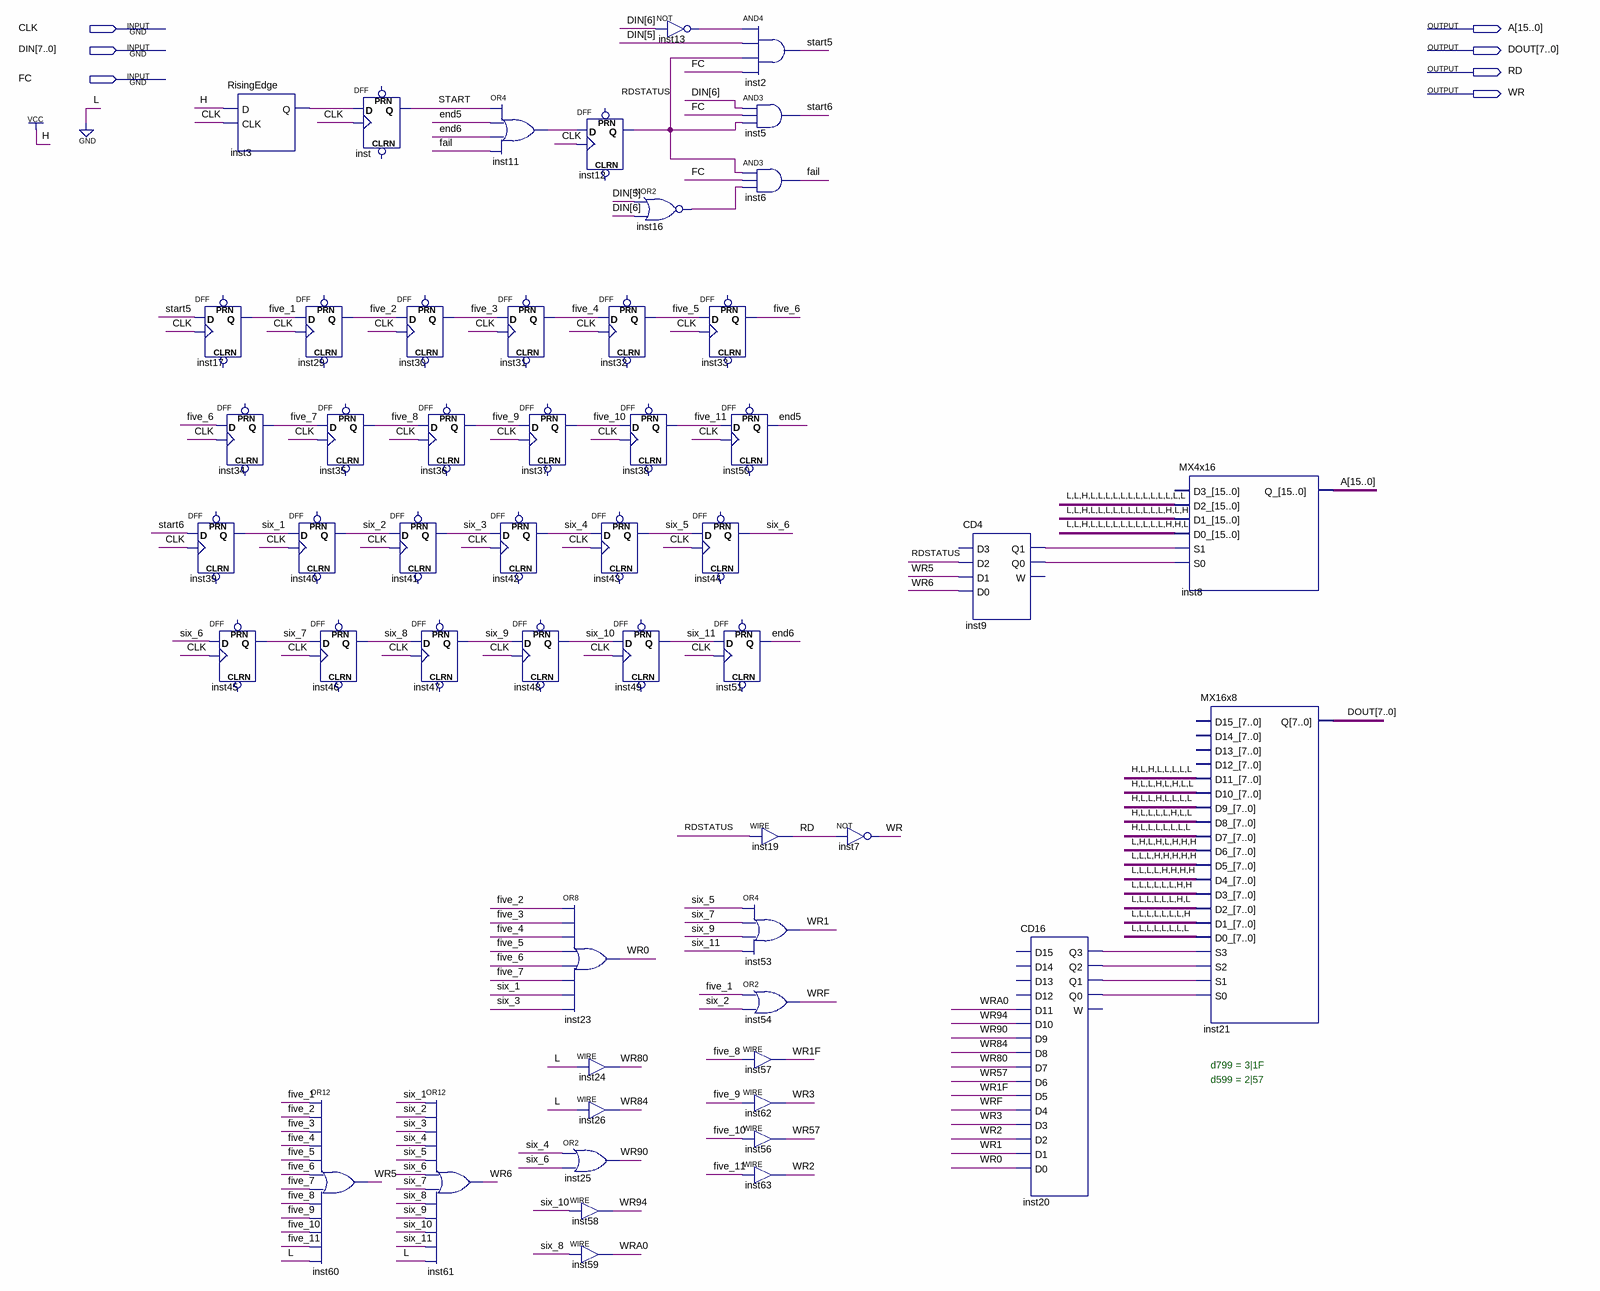
[diagram p0: schematic sheet]
// Quartus schematic GPUTEST.bdf as structural Verilog: 53 symbols, 7 pins
module GPUTEST (
  input  CLK,
  input  [7:0] DIN,
  input  FC,
  output [15:0] A,
  output [7:0] DOUT,
  output RD,
  output WR
);

  wire end5, end6, fail, five_1, five_2, five_3, five_4, five_5, five_6, five_7, five_8, five_9, five_10,
       five_11, inst3_q, inst9_q0, inst9_q1, inst11_out, inst13_out, inst16_out, inst20_q0, inst20_q1,
       inst20_q2, inst20_q3, RDSTATUS, six_1, six_2, six_3, six_4, six_5, six_6, six_7, six_8, six_9, six_10,
       six_11, START, start5, start6, WR0, WR1, WR1F, WR2, WR3, WR5, WR6, WR57, WR80, WR84, WR90, WR94, WRA0,
       WRF;

  RisingEdge inst3 (.D(1'b1), .CLK(CLK), .Q(inst3_q));
  DFF inst17 (.CLK(CLK), .D(start5), .Q(five_1));  // open: CLRN, PRN
  DFF inst34 (.CLK(CLK), .D(five_6), .Q(five_7));  // open: CLRN, PRN
  DFF inst39 (.CLK(CLK), .D(start6), .Q(six_1));  // open: CLRN, PRN
  DFF inst45 (.CLK(CLK), .D(six_6), .Q(six_7));  // open: CLRN, PRN
  DFF inst29 (.CLK(CLK), .D(five_1), .Q(five_2));  // open: CLRN, PRN
  DFF inst40 (.CLK(CLK), .D(six_1), .Q(six_2));  // open: CLRN, PRN
  DFF inst (.CLK(CLK), .D(inst3_q), .Q(START));  // open: CLRN, PRN
  DFF inst35 (.CLK(CLK), .D(five_7), .Q(five_8));  // open: CLRN, PRN
  DFF inst46 (.CLK(CLK), .D(six_7), .Q(six_8));  // open: CLRN, PRN
  or inst60 (WR5, five_1, five_2, five_3, five_4, five_5, five_6, five_7, five_8, five_9, five_10, five_11, 1'b0);
  DFF inst30 (.CLK(CLK), .D(five_2), .Q(five_3));  // open: CLRN, PRN
  DFF inst41 (.CLK(CLK), .D(six_2), .Q(six_3));  // open: CLRN, PRN
  DFF inst47 (.CLK(CLK), .D(six_8), .Q(six_9));  // open: CLRN, PRN
  DFF inst36 (.CLK(CLK), .D(five_8), .Q(five_9));  // open: CLRN, PRN
  or inst61 (WR6, six_1, six_2, six_3, six_4, six_5, six_6, six_7, six_8, six_9, six_10, six_11, 1'b0);
  or inst11 (inst11_out, START, end5, end6, fail);
  DFF inst31 (.CLK(CLK), .D(five_3), .Q(five_4));  // open: CLRN, PRN
  DFF inst37 (.CLK(CLK), .D(five_9), .Q(five_10));  // open: CLRN, PRN
  DFF inst42 (.CLK(CLK), .D(six_3), .Q(six_4));  // open: CLRN, PRN
  DFF inst48 (.CLK(CLK), .D(six_9), .Q(six_10));  // open: CLRN, PRN
  DFF inst12 (.CLK(CLK), .D(inst11_out), .Q(RDSTATUS));  // open: CLRN, PRN
  or inst23 (WR0, five_2, five_3, five_4, five_5, five_6, five_7, six_1, six_3);
  assign WR80 = 1'b0;  // WIRE inst24
  assign WR84 = 1'b0;  // WIRE inst26
  or inst25 (WR90, six_4, six_6);
  assign WR94 = six_10;  // WIRE inst58
  assign WRA0 = six_8;  // WIRE inst59
  nor inst16 (inst16_out, DIN[5], DIN[6]);
  DFF inst32 (.CLK(CLK), .D(five_4), .Q(five_5));  // open: CLRN, PRN
  DFF inst38 (.CLK(CLK), .D(five_10), .Q(five_11));  // open: CLRN, PRN
  DFF inst43 (.CLK(CLK), .D(six_4), .Q(six_5));  // open: CLRN, PRN
  DFF inst49 (.CLK(CLK), .D(six_10), .Q(six_11));  // open: CLRN, PRN
  not inst13 (inst13_out, DIN[6]);
  DFF inst33 (.CLK(CLK), .D(five_5), .Q(five_6));  // open: CLRN, PRN
  DFF inst44 (.CLK(CLK), .D(six_5), .Q(six_6));  // open: CLRN, PRN
  and inst2 (start5, inst13_out, DIN[5], RDSTATUS, FC);
  and inst5 (start6, DIN[6], FC, RDSTATUS);
  and inst6 (fail, RDSTATUS, FC, inst16_out);
  DFF inst50 (.CLK(CLK), .D(five_11), .Q(end5));  // open: CLRN, PRN
  DFF inst51 (.CLK(CLK), .D(six_11), .Q(end6));  // open: CLRN, PRN
  assign RD = RDSTATUS;  // WIRE inst19
  or inst53 (WR1, six_5, six_7, six_9, six_11);
  or inst54 (WRF, five_1, six_2);
  assign WR1F = five_8;  // WIRE inst57
  assign WR3 = five_9;  // WIRE inst62
  assign WR57 = five_10;  // WIRE inst56
  assign WR2 = five_11;  // WIRE inst63
  not inst7 (WR, RD);
  CD4 inst9 (.D2(RDSTATUS), .D1(WR5), .D0(WR6), .Q1(inst9_q1), .Q0(inst9_q0));  // open: D3, W
  CD16 inst20 (
    .D11(WRA0), .D10(WR94), .D9(WR90), .D8(WR84), .D7(WR80), .D6(WR57), .D5(WR1F), .D4(WRF), .D3(WR3),
    .D2(WR2), .D1(WR1), .D0(WR0), .Q3(inst20_q3), .Q2(inst20_q2), .Q1(inst20_q1), .Q0(inst20_q0));  // open: D15, D14, D13, D12, W
  MX4x16 inst8 (
    .D2_(16'b0010000000000000), .D1_(16'b0010000000000101), .D0_(16'b0010000000000110), .S1(inst9_q1),
    .S0(inst9_q0), .Q_(A));  // open: D3_
  MX16x8 inst21 (
    .D11_(8'b10100000), .D10_(8'b10010100), .D9_(8'b10010000), .D8_(8'b10000100), .D7_(8'b10000000),
    .D6_(8'b01010111), .D5_(8'b00011111), .D4_(8'b00001111), .D3_(8'b00000011), .D2_(8'b00000010),
    .D1_(8'b00000001), .D0_({8{1'b0}}), .S3(inst20_q3), .S2(inst20_q2), .S1(inst20_q1), .S0(inst20_q0),
    .Q(DOUT));  // open: D15_, D14_, D13_, D12_

  // Notes on the sheet:
  //   d799 = 3|1F
  //   d599 = 2|57
endmodule
